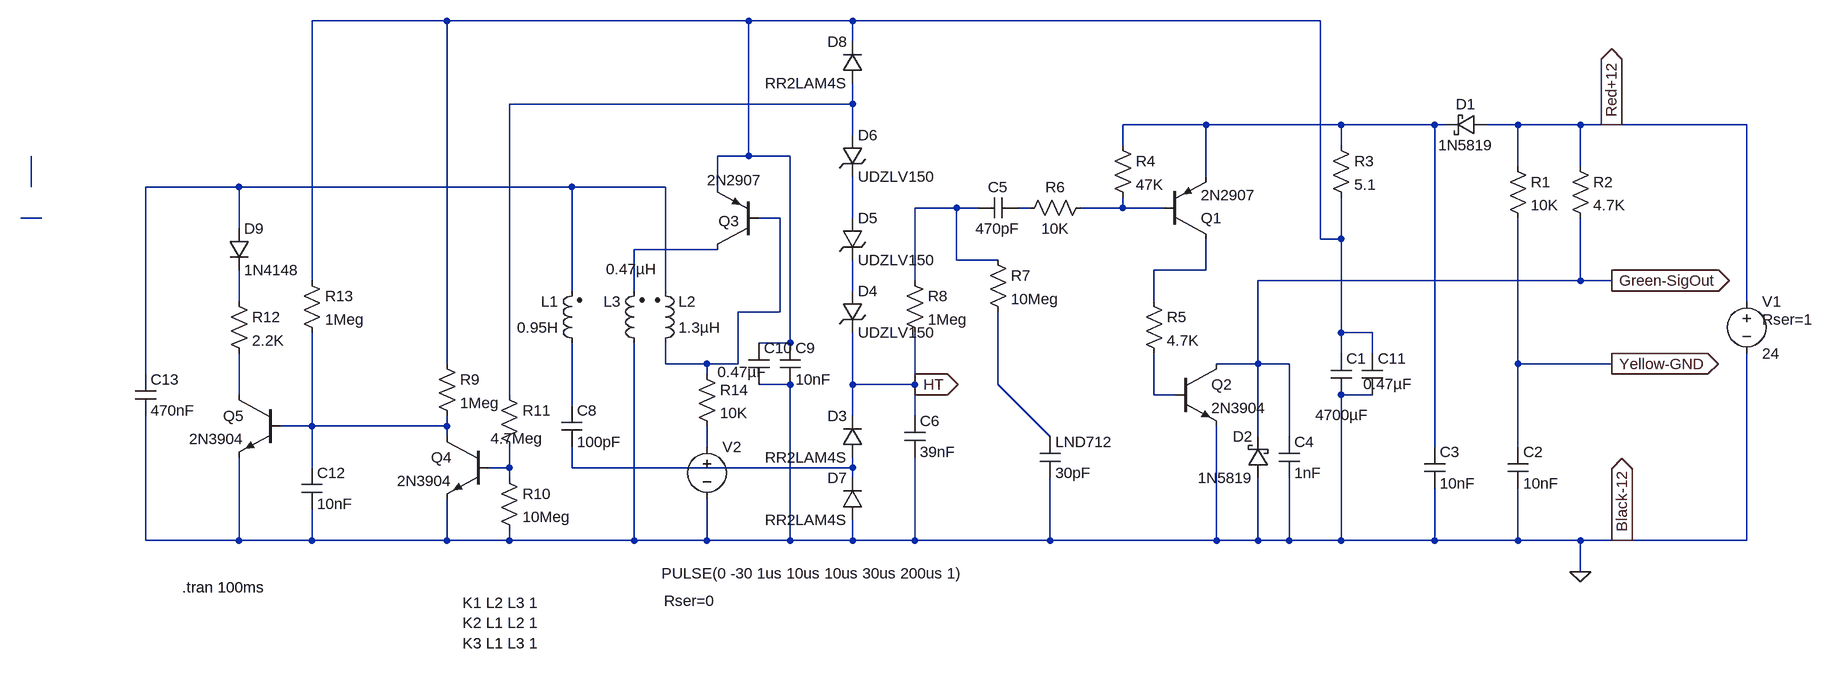
[diagram p0: schematic RM60.asc]
RM60.asc, the LTspice schematic file:
Version 4
SHEET 1 960 680
WIRE -1408 -576 -1616 -576
WIRE -944 -576 -1408 -576
WIRE -784 -576 -944 -576
WIRE -64 -576 -784 -576
WIRE -784 -544 -784 -576
WIRE -784 -448 -784 -480
WIRE -784 -448 -1312 -448
WIRE -240 -416 -368 -416
WIRE -32 -416 -240 -416
WIRE 112 -416 -32 -416
WIRE 128 -416 112 -416
WIRE 240 -416 192 -416
WIRE 336 -416 240 -416
WIRE 384 -416 336 -416
WIRE 592 -416 384 -416
WIRE -784 -400 -784 -448
WIRE -368 -384 -368 -416
WIRE -32 -384 -32 -416
WIRE -944 -368 -944 -576
WIRE -944 -368 -992 -368
WIRE -880 -368 -944 -368
WIRE 240 -352 240 -416
WIRE 336 -352 336 -416
WIRE -240 -336 -240 -416
WIRE -2048 -320 -2048 -368
WIRE -1728 -320 -1872 -320
WIRE -1216 -320 -1728 -320
WIRE -1072 -320 -1216 -320
WIRE -992 -320 -992 -368
WIRE -624 -288 -688 -288
WIRE -592 -288 -624 -288
WIRE -512 -288 -528 -288
WIRE -368 -288 -368 -304
WIRE -368 -288 -432 -288
WIRE -304 -288 -368 -288
WIRE -2032 -272 -2064 -272
WIRE -896 -272 -928 -272
WIRE -784 -272 -784 -336
WIRE -1728 -256 -1728 -320
WIRE -64 -240 -64 -576
WIRE -32 -240 -32 -304
WIRE -32 -240 -64 -240
WIRE -992 -224 -1120 -224
WIRE -624 -208 -624 -288
WIRE -560 -208 -624 -208
WIRE -240 -192 -240 -240
WIRE -240 -192 -320 -192
WIRE -1616 -176 -1616 -576
WIRE -688 -176 -688 -288
WIRE 336 -176 336 -272
WIRE 336 -176 -160 -176
WIRE 384 -176 336 -176
WIRE -1216 -160 -1216 -320
WIRE -1120 -160 -1120 -224
WIRE -1072 -160 -1072 -320
WIRE -784 -160 -784 -208
WIRE -1728 -144 -1728 -192
WIRE -320 -144 -320 -192
WIRE 592 -144 592 -416
WIRE -896 -128 -896 -272
WIRE -896 -128 -960 -128
WIRE -32 -96 -32 -240
WIRE 16 -96 -32 -96
WIRE -880 -80 -880 -368
WIRE -880 -80 -928 -80
WIRE -32 -64 -32 -96
WIRE 16 -64 16 -96
WIRE -1408 -48 -1408 -576
WIRE -1072 -48 -1072 -80
WIRE -1008 -48 -1072 -48
WIRE -960 -48 -960 -128
WIRE -960 -48 -1008 -48
WIRE -160 -48 -160 -176
WIRE -160 -48 -224 -48
WIRE -112 -48 -160 -48
WIRE 240 -48 240 -272
WIRE 384 -48 240 -48
WIRE -1872 -32 -1872 -320
WIRE -1008 -32 -1008 -48
WIRE -880 -16 -928 -16
WIRE -784 -16 -784 -96
WIRE -688 -16 -688 -96
WIRE -688 -16 -784 -16
WIRE -560 -16 -560 -128
WIRE -1728 0 -1728 -64
WIRE -1312 0 -1312 -448
WIRE -320 0 -320 -64
WIRE -288 0 -320 0
WIRE 16 0 -32 0
WIRE -1216 16 -1216 -80
WIRE -784 32 -784 -16
WIRE -688 32 -688 -16
WIRE -1616 48 -1616 -96
WIRE -1616 48 -1664 48
WIRE -1408 48 -1408 32
WIRE -1408 48 -1616 48
WIRE -1408 64 -1408 48
WIRE -480 64 -560 -16
WIRE -160 64 -160 -48
WIRE -112 64 -112 -48
WIRE -1008 80 -1008 48
WIRE 112 80 112 -416
WIRE 240 80 240 -48
WIRE -1616 112 -1616 48
WIRE -1312 112 -1312 80
WIRE -1312 112 -1344 112
WIRE -1216 112 -1216 80
WIRE -784 112 -784 96
WIRE -784 112 -1216 112
WIRE -1312 128 -1312 112
WIRE -784 128 -784 112
WIRE -1872 224 -1872 32
WIRE -1728 224 -1728 96
WIRE -1728 224 -1872 224
WIRE -1616 224 -1616 176
WIRE -1616 224 -1728 224
WIRE -1408 224 -1408 160
WIRE -1408 224 -1616 224
WIRE -1312 224 -1312 208
WIRE -1312 224 -1408 224
WIRE -1120 224 -1120 -80
WIRE -1120 224 -1312 224
WIRE -1008 224 -1008 160
WIRE -1008 224 -1120 224
WIRE -880 224 -880 -16
WIRE -880 224 -1008 224
WIRE -784 224 -784 192
WIRE -784 224 -880 224
WIRE -688 224 -688 96
WIRE -688 224 -784 224
WIRE -480 224 -480 128
WIRE -480 224 -688 224
WIRE -224 224 -224 48
WIRE -224 224 -480 224
WIRE -160 224 -160 128
WIRE -160 224 -224 224
WIRE -112 224 -112 128
WIRE -112 224 -160 224
WIRE -32 224 -32 0
WIRE -32 224 -112 224
WIRE 112 224 112 144
WIRE 112 224 -32 224
WIRE 240 224 240 144
WIRE 240 224 112 224
WIRE 336 224 240 224
WIRE 400 224 336 224
WIRE 592 224 592 -64
WIRE 592 224 400 224
WIRE 336 272 336 224
FLAG 336 272 0
FLAG 384 -48 Yellow-GND
IOPIN 384 -48 Out
FLAG 400 224 Black-12
IOPIN 400 224 Out
FLAG 384 -176 Green-SigOut
IOPIN 384 -176 Out
FLAG 384 -416 Red+12
IOPIN 384 -416 Out
FLAG -688 -16 HT
IOPIN -688 -16 Out
SYMBOL cap -48 -64 R0
WINDOW 3 -24 95 Left 2
SYMATTR Value 4700µF
SYMATTR InstName C1
SYMATTR SpiceLine V=35
SYMBOL res 224 -368 R0
SYMATTR InstName R1
SYMATTR Value 10K
SYMBOL cap 224 80 R0
SYMATTR InstName C2
SYMATTR Value 10nF
SYMBOL res 320 -368 R0
SYMATTR InstName R2
SYMATTR Value 4.7K
SYMBOL schottky 192 -432 R90
WINDOW 0 0 32 VBottom 2
WINDOW 3 32 32 VTop 2
SYMATTR InstName D1
SYMATTR Value 1N5819
SYMATTR Description Diode
SYMATTR Type diode
SYMBOL cap 96 80 R0
SYMATTR InstName C3
SYMATTR Value 10nF
SYMBOL res -48 -400 R0
SYMATTR InstName R3
SYMATTR Value 5.1
SYMBOL pnp -304 -240 M180
SYMATTR InstName Q1
SYMATTR Value 2N2907
SYMBOL res -384 -400 R0
SYMATTR InstName R4
SYMATTR Value 47K
SYMBOL npn -288 -48 R0
SYMATTR InstName Q2
SYMATTR Value 2N3904
SYMBOL res -336 -160 R0
SYMATTR InstName R5
SYMATTR Value 4.7K
SYMBOL schottky -144 128 R180
WINDOW 0 24 64 Left 2
WINDOW 3 24 0 Left 2
SYMATTR InstName D2
SYMATTR Value 1N5819
SYMATTR Description Diode
SYMATTR Type diode
SYMBOL cap -128 64 R0
SYMATTR InstName C4
SYMATTR Value 1nF
SYMBOL res -416 -304 R90
WINDOW 0 0 56 VBottom 2
WINDOW 3 32 56 VTop 2
SYMATTR InstName R6
SYMATTR Value 10K
SYMBOL cap -528 -304 R90
WINDOW 0 0 32 VBottom 2
WINDOW 3 32 32 VTop 2
SYMATTR InstName C5
SYMATTR Value 470pF
SYMBOL res -576 -224 R0
SYMATTR InstName R7
SYMATTR Value 10Meg
SYMBOL res -704 -192 R0
SYMATTR InstName R8
SYMATTR Value 1Meg
SYMBOL cap -704 32 R0
SYMATTR InstName C6
SYMATTR Value 39nF
SYMBOL diode -768 96 R180
WINDOW 0 24 64 Left 2
WINDOW 3 24 0 Left 2
SYMATTR InstName D3
SYMATTR Value RR2LAM4S
SYMBOL cap -496 64 R0
SYMATTR InstName LND712
SYMATTR Value 30pF
SYMBOL zener -800 -160 R0
SYMATTR InstName D4
SYMATTR Value UDZLV150
SYMATTR Description Diode
SYMATTR Type diode
SYMBOL zener -800 -272 R0
SYMATTR InstName D5
SYMATTR Value UDZLV150
SYMATTR Description Diode
SYMATTR Type diode
SYMBOL zener -800 -400 R0
SYMATTR InstName D6
SYMATTR Value UDZLV150
SYMATTR Description Diode
SYMATTR Type diode
SYMBOL diode -768 192 R180
WINDOW 0 24 64 Left 2
WINDOW 3 24 0 Left 2
SYMATTR InstName D7
SYMATTR Value RR2LAM4S
SYMBOL ind2 -1200 -64 R180
WINDOW 0 36 80 Left 2
WINDOW 3 36 40 Left 2
SYMATTR InstName L1
SYMATTR Value 0.95H
SYMATTR Type ind
SYMATTR SpiceLine Rser=540
SYMBOL ind2 -1088 -64 M180
WINDOW 0 36 80 Left 2
WINDOW 3 36 40 Left 2
SYMATTR InstName L2
SYMATTR Value 1.3µH
SYMATTR Type ind
SYMATTR SpiceLine Rser=0.1
SYMBOL ind2 -1104 -64 R180
WINDOW 0 36 80 Left 2
WINDOW 3 -19 130 Left 2
SYMATTR InstName L3
SYMATTR Value 0.47µH
SYMATTR Type ind
SYMATTR SpiceLine Rser=0.01
SYMBOL pnp -928 -224 R180
WINDOW 0 30 44 Left 2
WINDOW 3 -5 107 Left 2
SYMATTR InstName Q3
SYMATTR Value 2N2907
SYMBOL diode -768 -480 R180
WINDOW 0 24 64 Left 2
WINDOW 3 24 0 Left 2
SYMATTR InstName D8
SYMATTR Value RR2LAM4S
SYMBOL cap -896 -80 R0
SYMATTR InstName C9
SYMATTR Value 10nF
SYMBOL cap -944 -80 R0
WINDOW 3 -48 45 Left 2
SYMATTR Value 0.47µF
SYMATTR InstName C10
SYMBOL cap 0 -64 R0
WINDOW 3 2 47 Left 2
SYMATTR Value 0.47µF
SYMATTR InstName C11
SYMBOL diode -1744 -256 R0
SYMATTR InstName D9
SYMATTR Value 1N4148
SYMBOL npn -1344 64 M0
SYMATTR InstName Q4
SYMATTR Value 2N3904
SYMBOL res -1424 -64 R0
SYMATTR InstName R9
SYMATTR Value 1Meg
SYMBOL res -1328 112 R0
SYMATTR InstName R10
SYMATTR Value 10Meg
SYMBOL res -1328 -16 R0
WINDOW 3 -13 83 Left 2
SYMATTR Value 4.7Meg
SYMATTR InstName R11
SYMBOL cap -1632 112 R0
SYMATTR InstName C12
SYMATTR Value 10nF
SYMBOL npn -1664 0 M0
SYMATTR InstName Q5
SYMATTR Value 2N3904
SYMBOL res -1744 -160 R0
SYMATTR InstName R12
SYMATTR Value 2.2K
SYMBOL res -1632 -192 R0
SYMATTR InstName R13
SYMATTR Value 1Meg
SYMBOL voltage 592 -160 R0
WINDOW 123 0 0 Left 0
WINDOW 39 24 44 Left 2
SYMATTR SpiceLine Rser=1
SYMATTR InstName V1
SYMATTR Value 24
SYMBOL voltage -1008 64 R0
WINDOW 3 -70 211 Left 2
WINDOW 123 0 0 Left 0
WINDOW 39 -66 253 Left 2
SYMATTR Value PULSE(0 -30 1us 10us 10us 30us 200us 1)
SYMATTR SpiceLine Rser=0
SYMATTR InstName V2
SYMBOL cap -1232 16 R0
SYMATTR InstName C8
SYMATTR Value 100pF
SYMBOL cap -1888 -32 R0
SYMATTR InstName C13
SYMATTR Value 470nF
SYMBOL res -1024 -48 R0
SYMATTR InstName R14
SYMATTR Value 10K
TEXT -1816 296 Left 2 !.tran 100ms
TEXT -1384 320 Left 2 !K1 L2 L3 1\nK2 L1 L2 1\nK3 L1 L3 1

The netlist it stands for:
* RM60.asc
C1 N001 0 4700µF V=35
R1 Red+12 Yellow-GND 10K
C2 Yellow-GND 0 10nF
R2 Red+12 Green-SigOut 4.7K
D1 Red+12 N003 1N5819
C3 N003 0 10nF
R3 N003 N001 5.1
Q1 N013 N008 N003 0 2N2907
R4 N003 N008 47K
Q2 Green-SigOut N018 0 0 2N3904
R5 N013 N018 4.7K
D2 0 Green-SigOut 1N5819
C4 Green-SigOut 0 1nF
R6 N008 N007 10K
C5 N007 N006 470pF
R7 N006 N016 10Meg
R8 N006 HT 1Meg
C6 HT 0 39nF
D3 N023 HT RR2LAM4S
C§LND712 N016 0 30pF
D4 N014 HT UDZLV150
D5 N011 N014 UDZLV150
D6 N002 N011 UDZLV150
D7 0 N023 RR2LAM4S
L1 N019 N005 0.95H Rser=540
L2 N010 N005 1.3µH Rser=0.1
L3 0 N012 0.47µH Rser=0.01
Q3 N012 N010 N001 0 2N2907
D8 N002 N001 RR2LAM4S
C9 N001 0 10nF
C10 N001 0 0.47µF
C11 N001 0 0.47µF
D9 N005 N015 1N4148
Q4 N020 N022 0 0 2N3904
R9 N001 N020 1Meg
R10 N022 0 10Meg
R11 N002 N022 4.7Meg
C12 N020 0 10nF
Q5 N017 N020 0 0 2N3904
R12 N015 N017 2.2K
R13 N001 N020 1Meg
V1 Red+12 0 24 Rser=1
V2 N021 0 PULSE(0 -30 1us 10us 10us 30us 200us 1) Rser=0
C8 N019 N023 100pF
C13 N005 0 470nF
R14 N010 N021 10K
.model D D
.lib standard.dio
.model NPN NPN
.model PNP PNP
.lib standard.bjt
.tran 100ms
K1 L2 L3 1
K2 L1 L2 1
K3 L1 L3 1
.backanno
.end